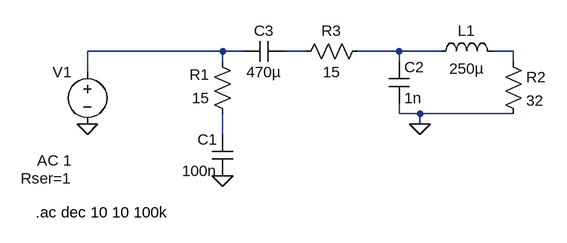
[diagram p0: schematic Draft5.asc]
Draft5.asc, the LTspice schematic file:
Version 4
SHEET 1 880 680
WIRE 128 64 -80 64
WIRE 160 64 128 64
WIRE 256 64 224 64
WIRE 400 64 336 64
WIRE 464 64 400 64
WIRE 576 64 544 64
WIRE 128 80 128 64
WIRE 400 80 400 64
WIRE 576 80 576 64
WIRE -80 96 -80 64
WIRE 400 160 400 144
WIRE 432 160 400 160
WIRE 576 160 432 160
WIRE 432 176 432 160
WIRE 128 192 128 160
FLAG -80 176 0
FLAG 128 256 0
FLAG 432 176 0
SYMBOL voltage -80 80 M0
WINDOW 123 24 152 Left 2
WINDOW 39 24 180 Left 2
SYMATTR InstName V1
SYMATTR Value ""
SYMATTR Value2 AC 1
SYMATTR SpiceLine Rser=1
SYMBOL res 144 176 R180
WINDOW 0 36 76 Left 2
WINDOW 3 36 40 Left 2
SYMATTR InstName R1
SYMATTR Value 15
SYMBOL cap 144 192 M0
SYMATTR InstName C1
SYMATTR Value 100n
SYMBOL cap 384 80 R0
SYMATTR InstName C2
SYMATTR Value 1n
SYMBOL res 560 64 R0
SYMATTR InstName R2
SYMATTR Value 32
SYMBOL res 352 48 R90
WINDOW 0 0 56 VBottom 2
WINDOW 3 32 56 VTop 2
SYMATTR InstName R3
SYMATTR Value 15
SYMBOL cap 224 48 R90
WINDOW 0 0 32 VBottom 2
WINDOW 3 32 32 VTop 2
SYMATTR InstName C3
SYMATTR Value 470µ
SYMBOL ind 448 80 R270
WINDOW 0 32 56 VTop 2
WINDOW 3 5 56 VBottom 2
SYMATTR InstName L1
SYMATTR Value 250µ
TEXT -160 312 Left 2 !.ac dec 10 10 100k

The netlist it stands for:
* Draft5.asc
V1 N001 0 AC 1 Rser=1
R1 N005 N001 15
C1 N005 0 100n
C2 N003 0 1n
R2 N004 0 32
R3 N003 N002 15
C3 N002 N001 470µ
L1 N003 N004 250µ
.ac dec 10 10 100k
.backanno
.end